# EAGLE design TTGO_shield_revF (EAGLE 9.0.1)
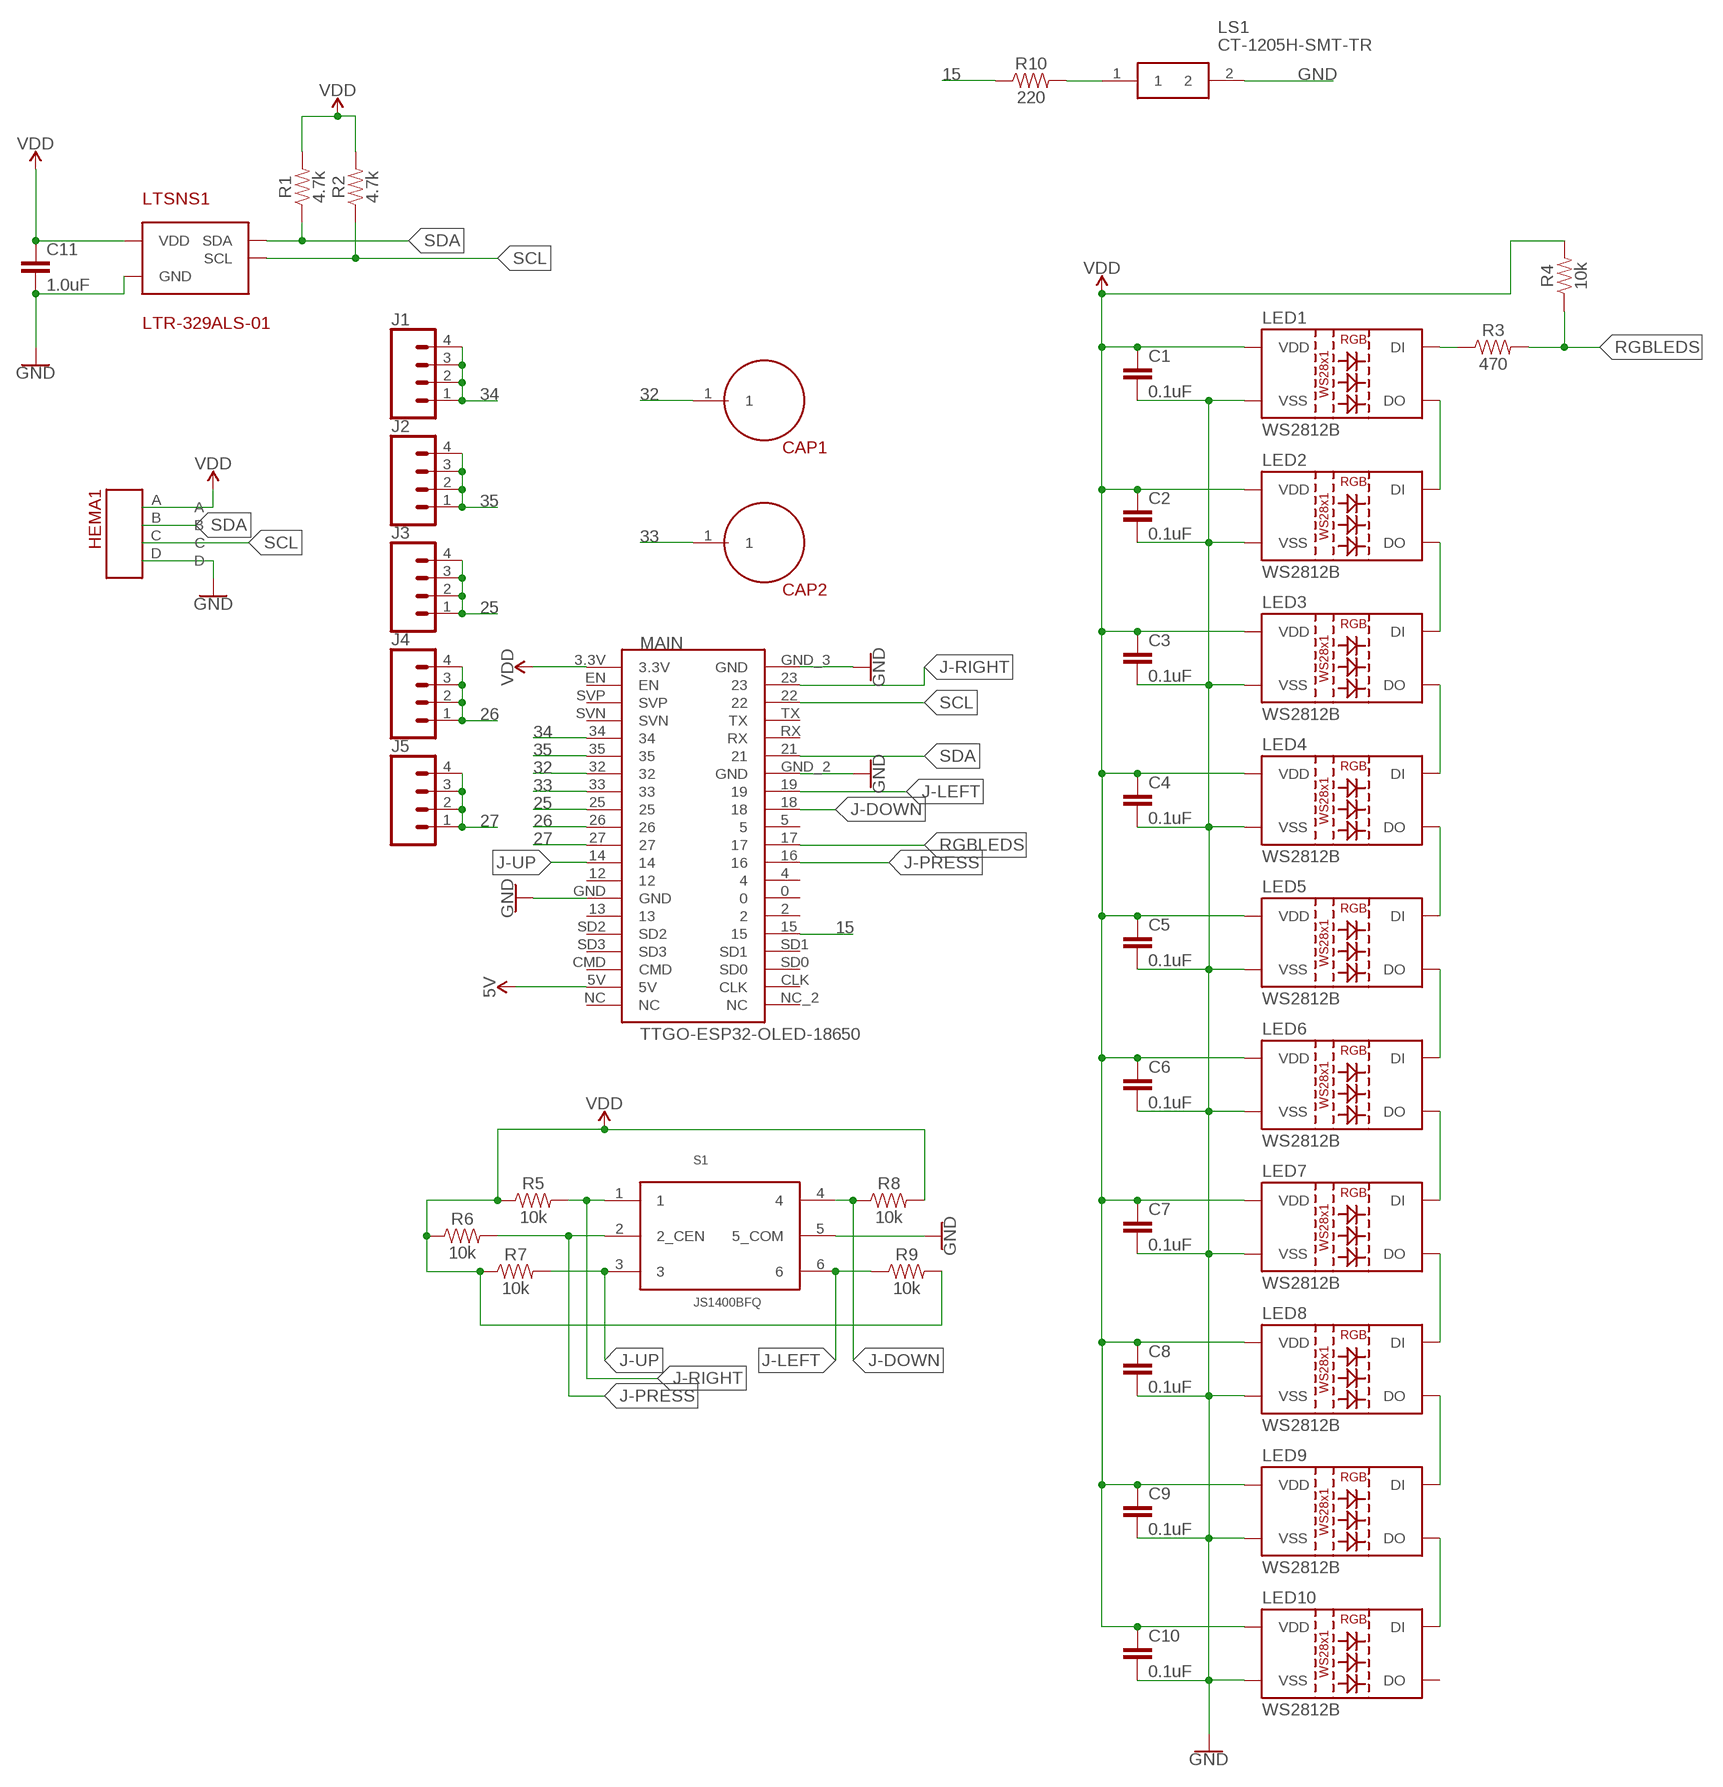
[diagram p0: schematic, sheet 1]

## Parts
C1  0.1uF  0.1UF-0603-25V-5%  [0603]
C2  0.1uF  0.1UF-0603-25V-5%  [0603]
C3  0.1uF  0.1UF-0603-25V-5%  [0603]
C4  0.1uF  0.1UF-0603-25V-5%  [0603]
C5  0.1uF  0.1UF-0603-25V-5%  [0603]
C6  0.1uF  0.1UF-0603-25V-5%  [0603]
C7  0.1uF  0.1UF-0603-25V-5%  [0603]
C8  0.1uF  0.1UF-0603-25V-5%  [0603]
C9  0.1uF  0.1UF-0603-25V-5%  [0603]
C10  0.1uF  0.1UF-0603-25V-5%  [0603]
C11  1.0uF  1.0UF-0805-25V-10%  [0805]
CAP1  CAPSENSE_BUTTON  [CAPSENSE_BUTTON]
CAP2  CAPSENSE_BUTTON  [CAPSENSE_BUTTON]
HEMA1  10120045-400LF  [10120045-400LF]
J1  CONN_04LONGPADS  [1X04_LONGPADS]
J2  CONN_04LONGPADS  [1X04_LONGPADS]
J3  CONN_04LONGPADS  [1X04_LONGPADS]
J4  CONN_04LONGPADS  [1X04_LONGPADS]
J5  CONN_04LONGPADS  [1X04_LONGPADS]
LED1  WS2812B  [WS2812B]
LED2  WS2812B  [WS2812B]
LED3  WS2812B  [WS2812B]
LED4  WS2812B  [WS2812B]
LED5  WS2812B  [WS2812B]
LED6  WS2812B  [WS2812B]
LED7  WS2812B  [WS2812B]
LED8  WS2812B  [WS2812B]
LED9  WS2812B  [WS2812B]
LED10  WS2812B  [WS2812B]
LS1  CT-1205H-SMT-TR  [CT1205HSMTTR]
LTSNS1  LTR-329ALS-01  [CHIPLED-4]
MAIN  TTGO-ESP32-OLED-18650  [TTGO-ESP32-OLED-18650]
R1  4.7k  4.7KOHM-0603-1/10W-1%  [0603]
R2  4.7k  4.7KOHM-0603-1/10W-1%  [0603]
R3  470  470OHM-0603-1/10W-1%  [0603]
R4  10k  10KOHM-0603-1/10W-1%  [0603]
R5  10k  10KOHM-0603-1/10W-1%  [0603]
R6  10k  10KOHM-0603-1/10W-1%  [0603]
R7  10k  10KOHM-0603-1/10W-1%  [0603]
R8  10k  10KOHM-0603-1/10W-1%  [0603]
R9  10k  10KOHM-0603-1/10W-1%  [0603]
R10  220  470OHM-0603-1/10W-1%  [0603]
S1  JS1400BFQ  [JS1400BFQ]

## Nets
5V: MAIN.5V
15: MAIN.15 R10.1
25: J3.1 J3.2 J3.3 J3.4 MAIN.25
26: J4.1 J4.2 J4.3 J4.4 MAIN.26
27: J5.1 J5.2 J5.3 J5.4 MAIN.27
32: CAP1.1 MAIN.32
33: CAP2.1 MAIN.33
34: J1.1 J1.2 J1.3 J1.4 MAIN.34
35: J2.1 J2.2 J2.3 J2.4 MAIN.35
GND [Rail]: C1.2 C2.2 C3.2 C4.2 C5.2 C6.2 C7.2 C8.2 C9.2 C10.2 C11.2 HEMA1.D LED1.3(VSS) LED2.3(VSS) LED3.3(VSS) LED4.3(VSS) LED5.3(VSS) LED6.3(VSS) LED7.3(VSS) LED8.3(VSS) LED9.3(VSS) LED10.3(VSS) LS1.2 LTSNS1.2(GND) MAIN.GND MAIN.GND_2(GND) MAIN.GND_3(GND) S1.5(5_COM)
J-DOWN: MAIN.18 R8.1 S1.4
J-LEFT: MAIN.19 R9.1 S1.6
J-PRESS: MAIN.16 R6.2 S1.2(2_CEN)
J-RIGHT: MAIN.23 R5.2 S1.1
J-UP: MAIN.14 R7.2 S1.3
N$1: LED5.2(DO) LED6.4(DI)
N$2: LED6.2(DO) LED7.4(DI)
N$3: LED7.2(DO) LED8.4(DI)
N$4: LED8.2(DO) LED9.4(DI)
N$5: LED4.2(DO) LED5.4(DI)
N$6: LED9.2(DO) LED10.4(DI)
N$7: LS1.1 R10.2
N$9: LED1.2(DO) LED2.4(DI)
N$10: LED2.2(DO) LED3.4(DI)
N$11: LED3.2(DO) LED4.4(DI)
N$12: LED1.4(DI) R3.1
RGBLEDS: MAIN.17 R3.2 R4.1
SCL: HEMA1.C LTSNS1.4(SCL) MAIN.22 R2.1
SDA: HEMA1.B LTSNS1.3(SDA) MAIN.21 R1.1
VDD [Rail]: C1.1 C2.1 C3.1 C4.1 C5.1 C6.1 C7.1 C8.1 C9.1 C10.1 C11.1 HEMA1.A LED1.1(VDD) LED2.1(VDD) LED3.1(VDD) LED4.1(VDD) LED5.1(VDD) LED6.1(VDD) LED7.1(VDD) LED8.1(VDD) LED9.1(VDD) LED10.1(VDD) LTSNS1.1(VDD) MAIN.3.3V R1.2 R2.2 R4.2 R5.1 R6.1 R7.1 R8.2 R9.2
Unconnected: LED10.2(DO) MAIN.0 MAIN.2 MAIN.4 MAIN.5 MAIN.12 MAIN.13 MAIN.CLK MAIN.CMD MAIN.EN MAIN.NC MAIN.NC_2(NC) MAIN.RX MAIN.SD0 MAIN.SD1 MAIN.SD2 MAIN.SD3 MAIN.SVN MAIN.SVP MAIN.TX

## Library data of the parts
C1-C10 = SparkFun-Capacitors:0.1UF: 0.1µF ceramic capacitors A capacitor is a passive two-terminal electrical component used to store electrical energy temporarily in an electric field.; PROD_ID: CAP-08604
C11 = SparkFun-Capacitors:1.0UF: 1µF ceramic capacitors A capacitor is a passive two-terminal electrical component used to store electrical energy temporarily in an electric field.; PROD_ID: CAP-08064
CAP1 CAP2 = BadgeParts:CAPSENSE_BUTTON: Simple pad for capsense buttons
HEMA1 = BadgeParts:10120045-400LF: SSL Connector 4 Position Blade and Receptacle, Hermaphroditic Board to Board 0.118" (3.00mm) Solder Datasheet <https://cdn.amphenol-icc.com/media/wysiwyg/files/drawing/10120045-400lf.pdf>
J1-J5 = SparkFun-Connectors:CONN_04: Multi connection point. Often used as Generic Header-pin footprint for 0.1 inch spaced/style header connections On any of the 0.1 inch spaced packages, you can populate with these: Break Away Headers - Straight <https://www.sparkfun.com/products/116> (PRT-00116) Break Away Male Headers - Right Angle <https://www.sparkfun.com/products/553> (PRT-00553) Female Headers <https://www.sparkfun.com/products/115> (PRT-00115) Break Away Headers - Machine Pin <https://www.sparkfun.com/products/117> (PRT-00117) Break Away Female Headers - Swiss Machine Pin <https://www.sparkfun.com/products/743> (PRT-00743) For SCREWTERMINALS and SPRING TERMINALS visit here: Screw Terimnals on SparkFun.com <https://www.sparkfun.com/search/results?term=Screw+Terminals> (5mm/3.5mm/2.54mm spacing) This device is also useful as a general connection point to wire up your design to another part of your project. Our various solder wires solder well into these plated through hole pads. Hook-Up Wire - Assortment (Stranded, 22 AWG) <https://www.sparkfun.com/products/11375> (PRT-11375) Hook-Up Wire - Assortment (Solid Core, 22 AWG) <https://www.sparkfun.com/products/11367> (PRT-11367) View the entire wire category on our website here <https://www.sparkfun.com/categories/141> Special notes: Molex polarized connector foot print use with SKU : PRT-08231 with associated crimp pins and housings. 1MM SMD Version SKU: PRT-10208; PROD_ID: CONN-09696
LED1-LED10 = SparkFun-LED:WS2812B: WS2812B SMD addressable RGB LED 5x5mm SMD LED with built-in controller IC. Color: Red/Green/Blue mC Rating: RGB: 390, 660, 180 mcd Forward Voltage: RGB: 2.0, 3.0, 3.0 V Packages:WS2812B SparkFun Products: Blynk Board - ESP8266 <https://www.sparkfun.com/products/13794>; PROD_ID: DIO-12503
LS1 = BadgeParts:CT-1205H-SMT-TR: Speakers & Transducers Buzzers Source: Datasheet <http://www.cui.com/product/resource/ct-1205h-smt.pdf>; ARROW_PART_NUMBER: CT-1205H-SMT-TR; ARROW_PRICE/STOCK: https://www.arrow.com/en/products/ct-1205h-smt-tr/cui-inc; DESCRIPTION: Speakers & Transducers Buzzers; HEIGHT: 10mm; MANUFACTURER_NAME: CUI; MANUFACTURER_PART_NUMBER: CT-1205H-SMT-TR
LTSNS1 = NickParts:LTR-329ALS-01
MAIN = BadgeParts:TTGO-ESP32-OLED-18650: Input-only pins: IO34, IO35, Sensor_VP, Sensor_VN, are labeled in docs as GPI (note the lack of O), which may mean they're input-only pins. Pins 4 and 5 go to the OLED SDA/SCL IO32 IO33 are connected to the crystal. Docs say you can't use these 2x pins as GPIO unless you desolder some stuff on the module. There's 5 "strapping" pins, which effect how the ESP-32 boots depending on if they're pulled high or low. So it's possible that something you've hooked upto these pins may effect how it boots. These pins are: 0 2 5 12 15
R1 R2 = SparkFun-Resistors:4.7KOHM: 4.7kΩ resistor A resistor is a passive two-terminal electrical component that implements electrical resistance as a circuit element. Resistors act to reduce current flow, and, at the same time, act to lower voltage levels within circuits. - Wikipedia; PROD_ID: RES-07857
R3 = SparkFun-Resistors:470OHM: 470Ω resistor A resistor is a passive two-terminal electrical component that implements electrical resistance as a circuit element. Resistors act to reduce current flow, and, at the same time, act to lower voltage levels within circuits. - Wikipedia; PROD_ID: RES-07869
R4-R9 = SparkFun-Resistors:10KOHM: 10kΩ resistor A resistor is a passive two-terminal electrical component that implements electrical resistance as a circuit element. Resistors act to reduce current flow, and, at the same time, act to lower voltage levels within circuits. - Wikipedia; PROD_ID: RES-00824
R10 = SparkFun-Resistors:470OHM: 470Ω resistor A resistor is a passive two-terminal electrical component that implements electrical resistance as a circuit element. Resistors act to reduce current flow, and, at the same time, act to lower voltage levels within circuits. - Wikipedia; PROD_ID: RES-07869; VALUE: 470
S1 = BadgeParts:JS1400BFQ: 5-way SMD tactile switch

## Net classes
0 Default: width 0.381 mm, clearance 0.254 mm
1 Rail: width 0.635 mm, clearance 0.254 mm

## Board
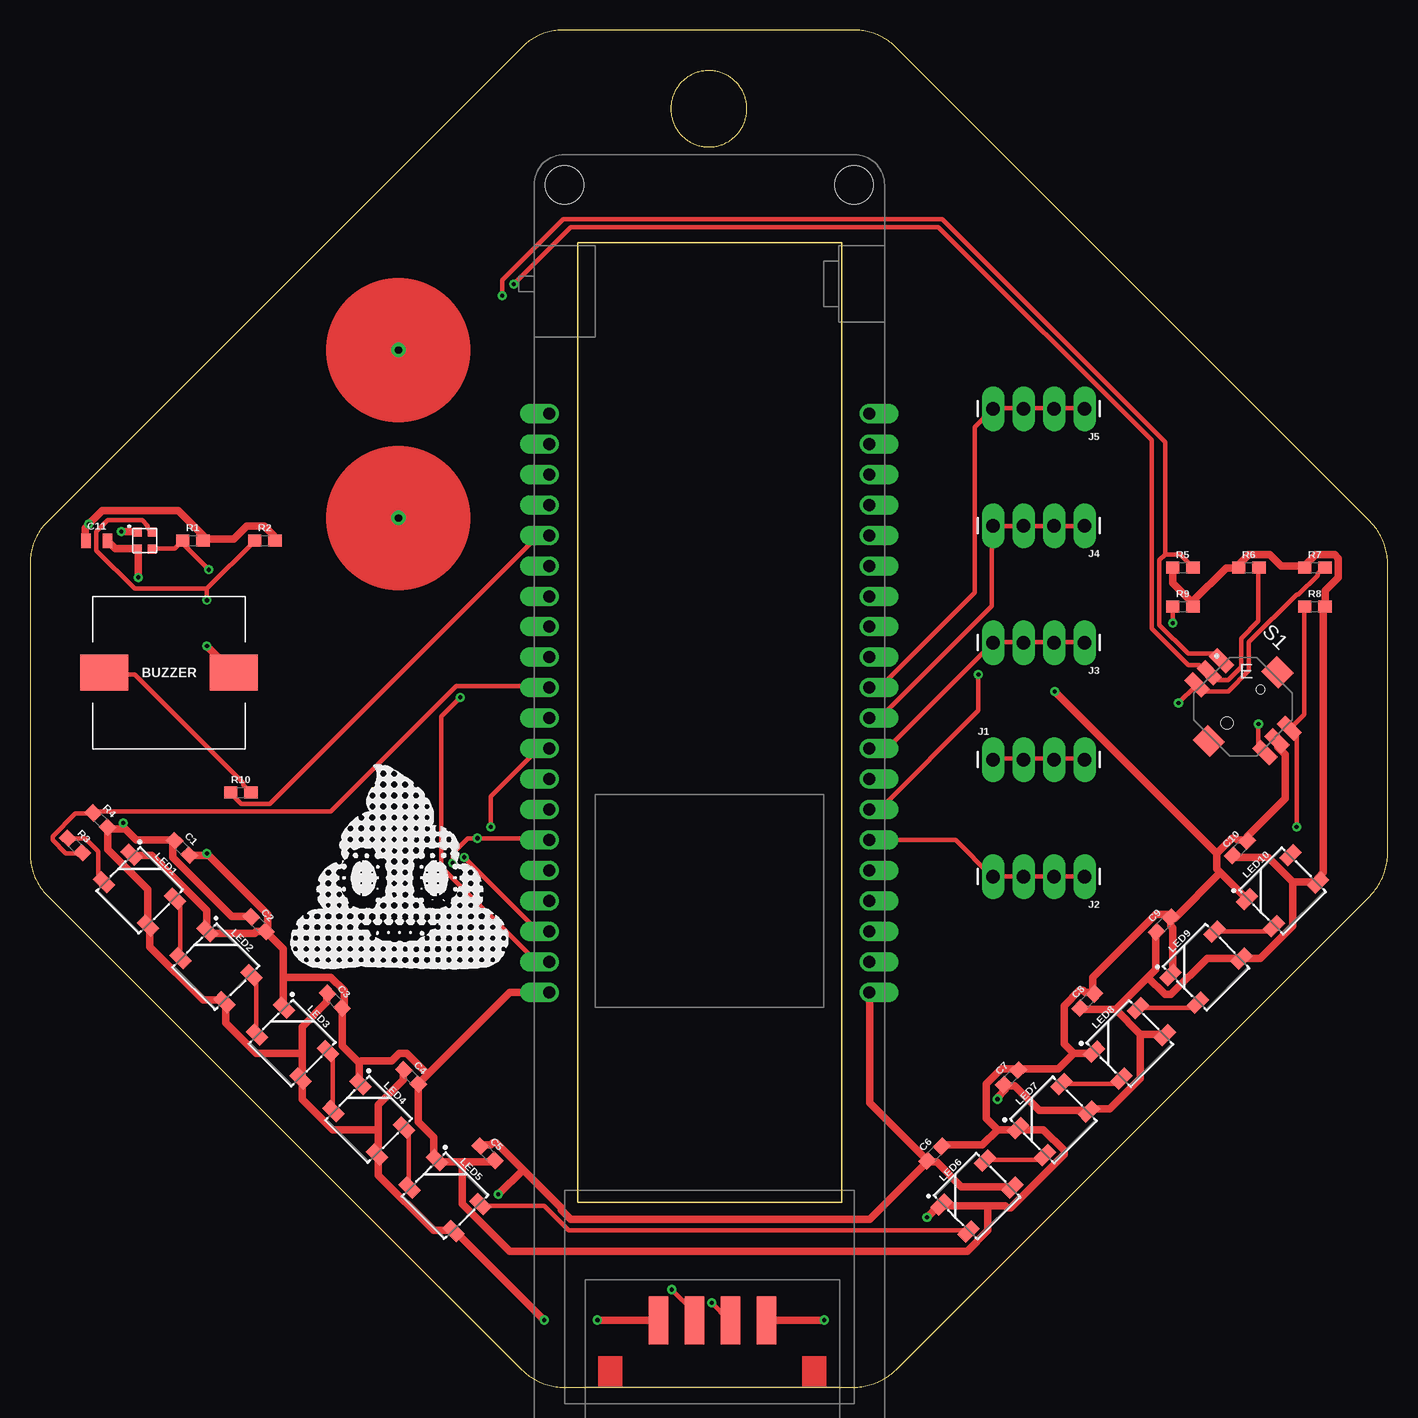
[diagram p1: board, top side]
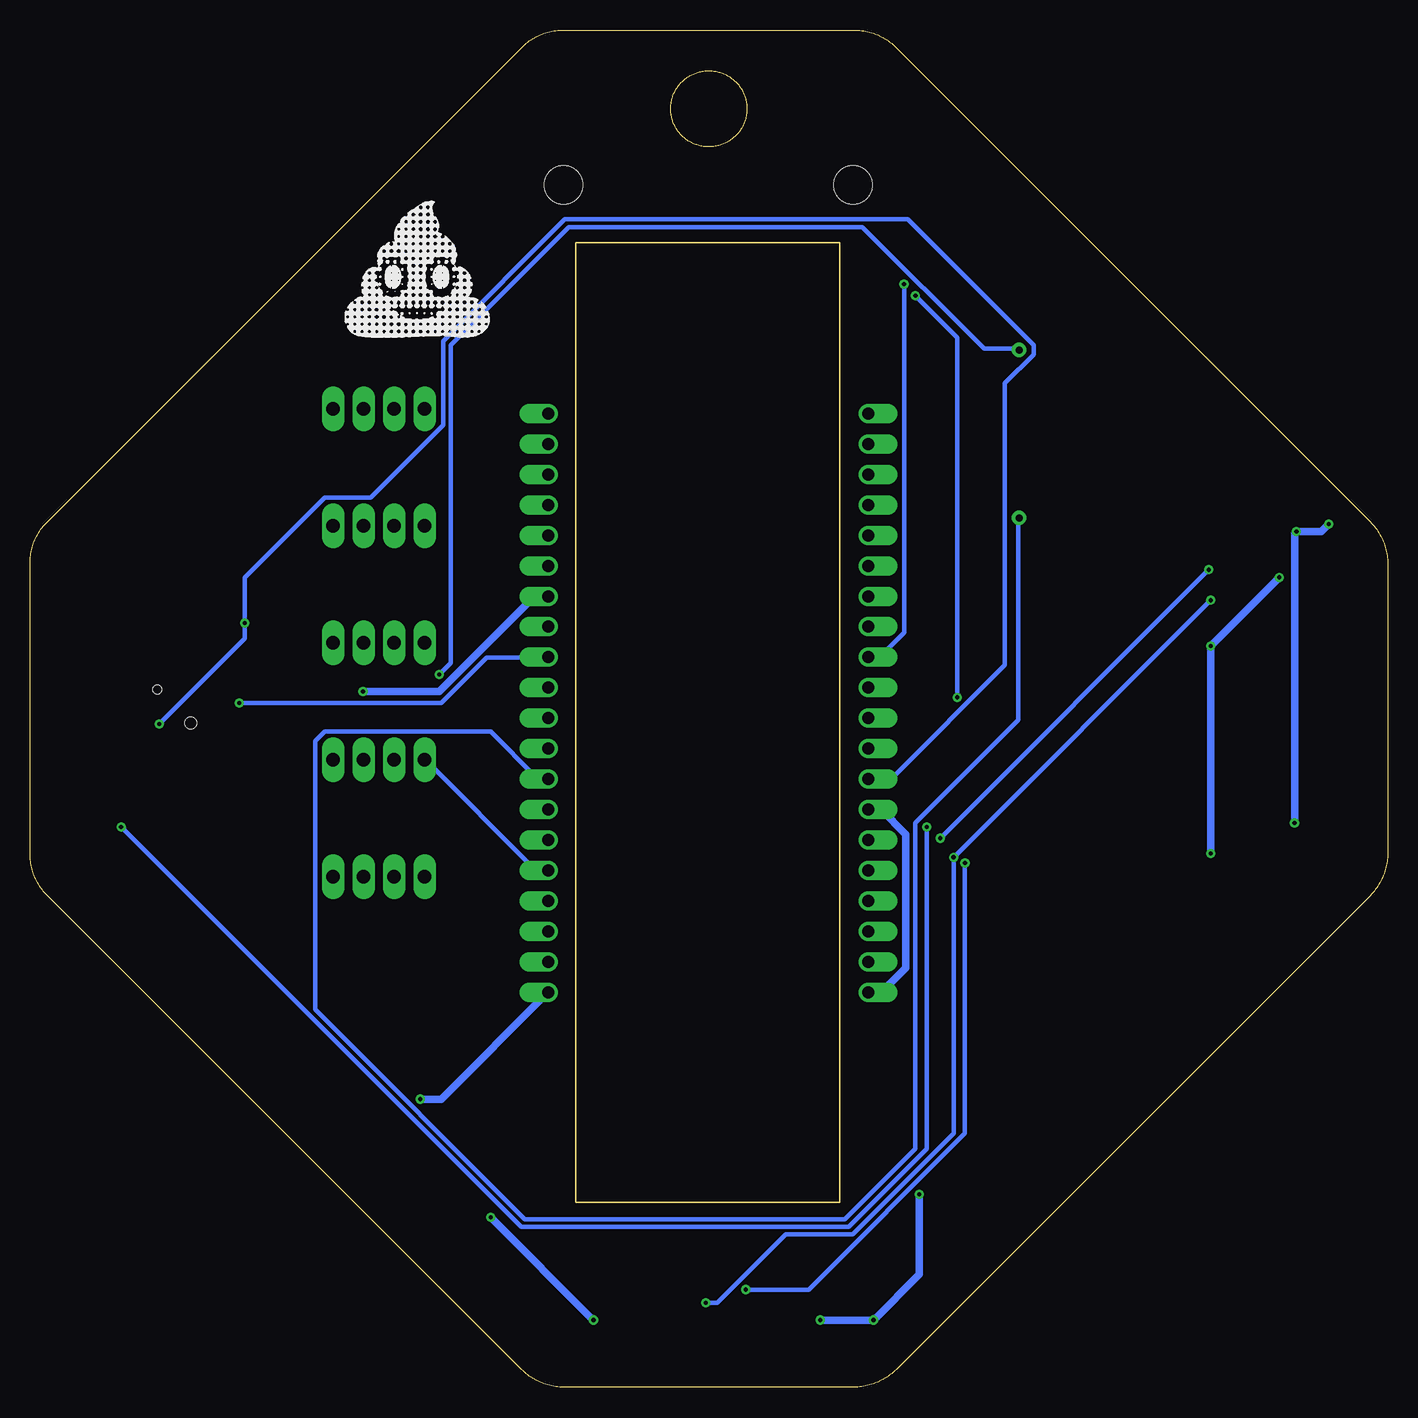
[diagram p2: board, bottom side, seen from below]

Size 113.14 x 113.14 mm. Coordinates in mm from the lower left corner, seen from the top.
Outline: 44.5,113.14 44.33,113.13 44.16,113.13 43.99,113.11 43.82,113.09 43.65,113.06 43.48,113.03 43.31,112.99 43.15,112.95 42.98,112.9 42.82,112.85 42.66,112.79 42.51,112.72 42.35,112.65 42.2,112.58 42.05,112.5 41.9,112.41 41.75,112.32 41.61,112.22 41.48,112.12 41.34,112.02 41.21,111.91 41.08,111.79 40.96,111.67 1.46,72.18 1.35,72.05 1.23,71.93 1.12,71.8 1.02,71.66 0.91,71.52 0.82,71.38 0.73,71.24 0.64,71.09 0.56,70.94 0.48,70.79 0.41,70.63 0.35,70.47 0.29,70.31 0.23,70.15 0.19,69.99 0.14,69.82 0.1,69.66 0.07,69.49 0.05,69.32 0.03,69.15 0.01,68.98 0,68.81 0,68.64 0,44.5 0,44.33 0.01,44.16 0.03,43.99 0.05,43.82 0.07,43.65 0.1,43.48 0.14,43.31 0.19,43.15 0.23,42.98 0.29,42.82 0.35,42.66 0.41,42.51 0.48,42.35 0.56,42.2 0.64,42.05 0.73,41.9 0.82,41.76 0.91,41.61 1.02,41.48 1.12,41.34 1.23,41.21 1.35,41.08 1.46,40.96 40.96,1.46 41.08,1.35 41.21,1.23 41.34,1.12 41.48,1.02 41.61,0.92 41.75,0.82 41.9,0.73 42.05,0.64 42.2,0.56 42.35,0.48 42.51,0.41 42.66,0.35 42.82,0.29 42.98,0.23 43.15,0.19 43.31,0.14 43.48,0.1 43.65,0.07 43.82,0.05 43.99,0.03 44.16,0.01 44.33,0 44.5,0 68.64,0 68.81,0 68.98,0.01 69.15,0.03 69.32,0.05 69.49,0.07 69.66,0.1 69.82,0.14 69.99,0.19 70.15,0.23 70.31,0.29 70.47,0.35 70.63,0.41 70.79,0.48 70.94,0.56 71.09,0.64 71.24,0.73 71.38,0.82 71.52,0.92 71.66,1.02 71.79,1.12 71.93,1.23 72.05,1.35 72.17,1.46 111.67,40.96 111.79,41.08 111.91,41.21 112.02,41.34 112.12,41.48 112.22,41.61 112.32,41.76 112.41,41.9 112.5,42.05 112.58,42.2 112.65,42.35 112.72,42.51 112.79,42.66 112.85,42.82 112.9,42.98 112.95,43.15 112.99,43.31 113.03,43.48 113.06,43.65 113.09,43.82 113.11,43.99 113.13,44.16 113.13,44.33 113.14,44.5 113.14,68.64 113.13,68.81 113.13,68.98 113.11,69.15 113.09,69.32 113.06,69.49 113.03,69.66 112.99,69.82 112.95,69.99 112.9,70.15 112.85,70.31 112.79,70.47 112.72,70.63 112.65,70.79 112.58,70.94 112.5,71.09 112.41,71.24 112.32,71.38 112.22,71.52 112.12,71.66 112.02,71.8 111.91,71.93 111.79,72.05 111.67,72.18 72.17,111.67 72.05,111.79 71.93,111.91 71.79,112.02 71.66,112.12 71.52,112.22 71.38,112.32 71.24,112.41 71.09,112.5 70.94,112.58 70.79,112.65 70.63,112.72 70.47,112.79 70.31,112.85 70.15,112.9 69.99,112.95 69.82,112.99 69.66,113.03 69.49,113.06 69.32,113.09 69.15,113.11 68.98,113.13 68.81,113.13 68.64,113.14 44.5,113.14
Outline: 59.74,106.57 59.74,106.68 59.74,106.79 59.73,106.9 59.71,107.01 59.7,107.12 59.67,107.23 59.65,107.33 59.62,107.44 59.59,107.54 59.55,107.65 59.51,107.75 59.47,107.85 59.43,107.95 59.38,108.05 59.32,108.15 59.27,108.24 59.21,108.34 59.14,108.43 59.08,108.51 59.01,108.6 58.94,108.68 58.86,108.76 58.78,108.84 58.7,108.92 58.62,108.99 58.54,109.06 58.45,109.13 58.36,109.19 58.27,109.25 58.17,109.31 58.08,109.36 57.98,109.41 57.88,109.46 57.78,109.5 57.67,109.54 57.57,109.58 57.47,109.61 57.36,109.64 57.25,109.67 57.14,109.69 57.03,109.71 56.93,109.72 56.82,109.73 56.71,109.74 56.6,109.74 56.49,109.74 56.38,109.74 56.27,109.73 56.16,109.72 56.05,109.7 55.94,109.68 55.83,109.66 55.72,109.63 55.62,109.6 55.51,109.56 55.41,109.53 55.31,109.48 55.21,109.44 55.11,109.39 55.01,109.34 54.92,109.28 54.82,109.22 54.73,109.16 54.64,109.09 54.56,109.03 54.47,108.95 54.39,108.88 54.31,108.8 54.24,108.72 54.16,108.64 54.09,108.56 54.03,108.47 53.96,108.38 53.9,108.29 53.84,108.2 53.79,108.1 53.74,108 53.69,107.9 53.64,107.8 53.6,107.7 53.56,107.6 53.53,107.49 53.5,107.39 53.47,107.28 53.45,107.17 53.43,107.06 53.42,106.95 53.41,106.84 53.4,106.73 53.39,106.62 53.39,106.51 53.4,106.4 53.41,106.29 53.42,106.18 53.43,106.07 53.45,105.97 53.47,105.86 53.5,105.75 53.53,105.65 53.56,105.54 53.6,105.44 53.64,105.33 53.69,105.23 53.74,105.13 53.79,105.04 53.84,104.94 53.9,104.85 53.96,104.76 54.03,104.67 54.09,104.58 54.16,104.5 54.24,104.41 54.31,104.33 54.39,104.26 54.47,104.18 54.56,104.11 54.64,104.04 54.73,103.98 54.82,103.92 54.92,103.86 55.01,103.8 55.11,103.75 55.21,103.7 55.31,103.65 55.41,103.61 55.51,103.57 55.62,103.54 55.72,103.51 55.83,103.48 55.94,103.46 56.05,103.44 56.16,103.42 56.27,103.41 56.38,103.4 56.49,103.39 56.6,103.39 56.71,103.4 56.82,103.4 56.93,103.41 57.03,103.43 57.14,103.45 57.25,103.47 57.36,103.49 57.47,103.52 57.57,103.56 57.67,103.59 57.78,103.63 57.88,103.68 57.98,103.72 58.08,103.77 58.17,103.83 58.27,103.89 58.36,103.95 58.45,104.01 58.54,104.08 58.62,104.15 58.7,104.22 58.78,104.29 58.86,104.37 58.94,104.45 59.01,104.54 59.08,104.62 59.14,104.71 59.21,104.8 59.27,104.89 59.32,104.99 59.38,105.09 59.43,105.18 59.47,105.28 59.51,105.39 59.55,105.49 59.59,105.59 59.62,105.7 59.65,105.8 59.67,105.91 59.7,106.02 59.71,106.13 59.73,106.24 59.74,106.35 59.74,106.46 59.74,106.57
Copper layers (1*16): Top 0.035mm / dielectric 1.5mm / Bottom 0.035mm
Design rules "default *": minimum track width 6mil, minimum drill 0.35mm, track to track 6mil, track to pad 6mil, pad to pad 6mil, via to via 6mil, smd to smd 6mil, copper to edge 40mil, drill to drill 6mil, minimum pad ring 12mil, minimum via ring 8mil, stop-mask expansion 4mil, vias tented up to drill 0mil, thermal gap 10mil

### Footprints (pad centres in the part's own frame; a part is rotated, then mirrored left to right if it is on the bottom)
0603 = smd 1.1 x 1: 1 -0.85,0; 2 0.85,0
0805 = smd 0.8 x 1.2: 1 -0.9,0; 2 0.9,0
CAPSENSE_BUTTON = drill 0.6: 1 0,0
10120045-400LF = smd 1.6 x 4: A 0.8,2; B 3.8,2; C 6.8,2; D 9.8,2
1X04_LONGPADS = drill 1.118 pad 1.88 long: 1 0,0; 2 2.54,0; 3 5.08,0; 4 7.62,0
WS2812B = smd 1.651 x 1: 1 2.577,-1.6; 2 2.577,1.6; 3 -2.577,1.6; 4 -2.577,-1.6
CT1205HSMTTR = smd 4 x 3: 1 -5.4,0; 2 5.4,0
CHIPLED-4 = smd 0.7 x 0.75: 1 -0.6,0.7; 2 -0.6,-0.7; 3 0.6,-0.7; 4 0.6,0.7
TTGO-ESP32-OLED-18650 = drill 1 offset: 0 26.67,16.51; 2 26.67,13.97; 3.3V 0,49.53; 4 26.67,19.05; 5 26.67,26.67; 5V 0,3.81; 12 0,19.05; 13 0,13.97; 14 0,21.59; 15 26.67,11.43; 16 26.67,21.59; 17 26.67,24.13; 18 26.67,29.21; 19 26.67,31.75; 21 26.67,36.83; 22 26.67,44.45; 23 26.67,46.99; 25 0,29.21; 26 0,26.67; 27 0,24.13; 32 0,34.29; 33 0,31.75; 34 0,39.37; 35 0,36.83; CLK 26.67,3.81; CMD 0,6.35; EN 0,46.99; GND 0,16.51; GND_2 26.67,34.29; GND_3 26.67,49.53; NC 0,1.27; NC_2 26.67,1.27; RX 26.67,39.37; SD0 26.67,6.35; SD1 26.67,8.89; SD2 0,11.43; SD3 0,8.89; SVN 0,41.91; SVP 0,44.45; TX 26.67,41.91 | hole 3.175: 1.27,-17.78; 25.4,-17.78
JS1400BFQ = smd 2 x 1: 1 -4,1.43; 2 -4,0; 3 -4,-1.43; 4 4,1.43; 5 4,0; 6 4,-1.43 | smd 2 x 1.8: P$1 0,4.05; P$2 0,-4.05 | hole 0.991: 0,-1.905 | hole 0.711: 0,2.032

### Placement (x,y rotation side)
C1  12.67,44.95 315 top
C2  19.03,38.59 315 top
C3  25.4,32.23 315 top
C4  31.76,25.86 315 top
C5  38.12,19.5 315 top
C6  75.38,19.46 45 top
C7  81.74,25.83 45 top
C8  88.1,32.19 45 top
C9  94.47,38.55 45 top
C10  100.83,44.92 45 top
C11  5.57,70.57 0 top
CAP1  30.71,86.46 0 top
CAP2  30.71,72.46 0 top
HEMA1  51.57,3.57 0 top
J1  80.26,52.32 0 top
J2  87.88,42.57 180 top
J3  87.88,62.07 180 top
J4  87.88,71.82 180 top
J5  87.88,81.57 180 top
LED1  9.13,41.42 315 top
LED2  15.5,35.05 315 top
LED3  21.86,28.69 315 top
LED4  28.23,22.33 315 top
LED5  34.59,15.96 315 top
LED6  78.91,15.93 45 top
LED7  85.28,22.29 45 top
LED8  91.64,28.65 45 top
LED9  98,35.02 45 top
LED10  104.37,41.38 45 top
LS1  11.57,59.57 0 top
LTSNS1  9.57,70.57 0 top
MAIN  69.94,82.44 180 top
R1  13.57,70.57 0 top
R2  19.57,70.57 0 top
R3  3.74,45.15 315 top
R4  5.86,47.28 315 top
R5  96.07,68.32 0 top
R6  101.57,68.32 0 top
R7  107.07,68.32 0 top
R8  107.07,65.07 0 top
R9  96.07,65.07 0 top
R10  17.57,49.57 0 top
S1  101.1,56.73 315 top

### Tracks (layer width: path | path; a pad name or v marks a point on that pad's centre or on a via)
15
  Top 0.381: R10.1 16.81,49.41 17.6,48.62 19.98,48.62 42.37,71 43.16,71 MAIN.15
25
  Top 0.381: J3.1 87.77,62.11 85.39,62.11 J3.2 85.23,62.11 82.85,62.11 J3.3 82.69,62.11 80.31,62.11 J3.4 80.15,61.95 71.58,53.38 69.99,53.38 MAIN.25
26
  Top 0.381: J4.1 87.77,71.79 85.39,71.79 J4.2 85.23,71.79 82.85,71.79 J4.3 82.69,71.79 80.31,71.79 J4.4 80.15,71.79 80.15,65.13 70.94,55.92 69.99,55.92 MAIN.26
27
  Top 0.381: J5.1 87.77,81.64 85.39,81.64 J5.2 85.23,81.64 82.85,81.64 J5.3 82.69,81.64 80.31,81.64 J5.4 80.15,81.48 78.72,80.05 78.72,66.24 70.94,58.46 69.99,58.46 MAIN.27
32  (via drill 0.35)
  Top 0.381: v79.04,59.41 79.04,56.4 70.94,48.3 69.99,48.3 MAIN.32
  Bottom 0.381: v79.04,59.41 78.08,60.36 78.08,86.88 68.24,96.72 43.79,96.72 33.64,86.56 30.78,86.56 CAP1.1
33
  Bottom 0.381: CAP2.1 30.78,72.43 30.78,55.6 39.35,47.03 39.35,19.88 45.22,14.01 71.89,14.01 89.36,31.47 89.36,53.86 88.56,54.65 74.75,54.65 70.94,50.84 69.99,50.84 MAIN.33
34
  Top 0.381: J1.4 87.77,52.43 85.39,52.43 J1.3 85.23,52.43 82.85,52.43 J1.2 82.69,52.43 80.31,52.43 J1.1
  Bottom 0.381: MAIN.34 69.99,43.22 71.1,43.22 80.15,52.27 J1.1
35
  Top 0.381: J2.1 87.77,42.58 85.39,42.58 J2.2 85.23,42.58 82.85,42.58 J2.3 82.69,42.58 80.31,42.58 J2.4 80.15,42.58 77.13,45.6 69.99,45.6 MAIN.35
GND  (via drill 0.35)
  Top 0.635: 27.44,27.03 26.02,28.46 26.02,31.47 C3.2 26.17,31.79 26.17,33.06 25.06,34.17 21.09,34.17 | 27.44,27.03 27.44,25.28 LED4.3 | 36.02,18.77 33.95,18.77 LED5.3 33.64,19.09 33.64,20.84 32.37,22.11 32.37,25.12 C4.2 32.52,25.44 33.16,26.07 | 36.02,18.77 38.71,18.77 C5.2 | 33.16,26.07 39.98,32.9 43.16,32.9 MAIN.GND_3 | 33.16,26.07 31.41,27.82 30.78,27.82 30.14,27.19 27.6,27.19 27.44,27.03 | C11.2 6.49,70.52 7.12,69.89 8.87,69.89 LTSNS1.2 9.03,69.57 v9.03,67.51 | v14.74,61.79 LS1.2 | C2.2 19.51,37.98 18.87,37.98 18.71,37.82 15.06,37.82 14.9,37.98 LED2.3 14.74,38.3 14.74,39.73 10.14,44.33 8.55,44.33 LED1.3 | 14.74,44.33 14.9,44.33 19.82,39.41 19.82,38.14 C2.2 | 14.74,44.33 13.32,44.33 C1.2 | 21.09,34.17 21.09,36.55 19.82,37.82 C2.2 | 21.09,34.17 21.09,31.79 LED3.3 | v14.74,44.49 14.74,44.33 | 86.97,27.82 85.71,26.55 82.37,26.55 C7.2 82.05,26.55 80.94,26.55 79.67,25.28 79.67,22.42 80.62,21.47 | 86.97,27.82 88.56,27.82 LED8.3 | 86.97,27.82 86.18,28.61 86.18,31.79 87.45,33.06 87.77,33.06 87.93,32.9 88.56,32.9 C8.2 88.56,33.22 88.56,34.17 93.8,39.41 94.91,39.41 C9.2 | 80.62,21.47 79.36,20.2 76.02,20.2 C6.2 | 80.62,21.47 82.21,21.47 LED7.3 82.53,21.47 84.43,21.47 86.18,19.72 86.18,19.41 81.74,14.96 81.42,14.96 81.26,15.12 79.83,15.12 | 79.83,15.12 76.02,15.12 LED6.3 75.7,15.12 v74.75,14.17 | v66.18,5.6 61.42,5.6 HEMA1.D | C9.2 95.07,39.09 95.07,38.46 95.23,38.3 95.23,34.49 95.07,34.33 LED9.3 | 98.88,44.49 100.15,45.76 100.47,45.76 100.63,45.6 101.42,45.6 C10.2 101.42,45.92 104.6,49.09 104.6,52.74 103.96,53.38 103.96,53.86 S1.5 | 98.88,44.49 98.88,43.22 99.2,42.9
  Top 0.635: 99.2,42.9 101.26,40.84 LED10.3 | 99.2,42.9 95.39,39.09 C9.2 | 98.88,44.49 v85.39,57.98 | 36.02,18.77 36.02,15.28 39.98,11.31 78.08,11.31 79.83,13.06 79.83,15.12
  Bottom 0.635: MAIN.GND_2 43.16,48.14 42.21,48.14 40.14,46.08 40.14,34.96 42.05,33.06 43.16,33.06 MAIN.GND_3 | v9.03,67.51 v14.74,61.79 v14.74,44.49 | v74.75,14.17 v66.18,5.6 | v85.39,57.98 79.04,57.98 71.1,65.92 69.99,65.92 MAIN.GND
J-DOWN  (via drill 0.35)
  Top 0.381: R8.1 106.18,64.97 106.18,56.08 105.07,54.97 S1.4 105.07,54.81 105.55,54.33 v105.55,46.71 | v38.4,46.71 38.4,49.25 42.37,53.22 43.16,53.22 MAIN.18
  Bottom 0.381: v38.4,46.71 38.4,19.88 44.91,13.37 72.21,13.37 v105.55,46.71
J-LEFT  (via drill 0.35)
  Top 0.381: v95.23,63.7 95.23,64.97 R9.1 | v102.37,55.28 102.37,53.38 102.85,52.9 S1.6
  Bottom 0.381: v102.37,55.28 95.23,62.43 v95.23,63.7 95.23,67.51 88.56,74.18 84.75,74.18 78.72,80.21 78.72,87.19 68.56,97.35 39.98,97.35 29.51,86.88 29.51,86.08 31.89,83.7 31.89,60.21 41.25,50.84 43.16,50.84 MAIN.19
J-PRESS  (via drill 0.35)
  Top 0.381: R6.2 102.37,68.3 102.37,63.86 100.94,62.43 100.94,60.05 99.83,58.94 98.88,58.94 98.4,59.41 S1.2 98.09,59.57 97.45,60.21 96.5,60.21 93.48,63.22 93.48,78.94 75.7,96.72 45.06,96.72 v40.3,91.96
  Bottom 0.381: v40.3,91.96 40.3,62.9 42.21,61 43.16,61 MAIN.16
J-RIGHT  (via drill 0.35)
  Top 0.381: 94.6,69.41 95.86,69.41 96.82,68.46 R5.2 | 94.6,69.41 94.12,68.94 94.12,63.54 96.5,61.16 98.72,61.16 99.2,60.68 S1.1 | v35.86,57.51 34.27,55.92 34.27,43.38 42.05,35.6 43.16,35.6 MAIN.23 | v39.35,91 39.35,92.27 44.43,97.35 76.02,97.35 94.6,78.78 94.6,69.41
  Bottom 0.381: v35.86,57.51 35.86,87.51 v39.35,91
J-UP  (via drill 0.35)
  Top 0.381: R7.2 107.77,68.3 107.3,67.83 107.3,67.67 105.71,66.08 105.55,66.08 101.58,62.11 101.58,59.73 99.83,57.98 97.77,57.98 97.29,58.46 S1.3 97.14,58.46 v95.71,57.03
  Bottom 0.381: v95.71,57.03 78.88,57.03 75.07,60.84 69.99,60.84 MAIN.14
N$1
  Top 0.381: LED5.2 37.6,15.12 42.84,15.12 44.91,13.06 78.08,13.06 LED6.4
N$2
  Top 0.381: LED6.2 79.67,18.93 84.12,18.93 84.43,19.25 LED7.4
N$3
  Top 0.381: LED7.2 86.02,25.28 90.63,25.28 90.94,25.6 LED8.4
N$4
  Top 0.381: LED8.2 92.37,31.63 96.98,31.63 97.29,31.95 LED9.4
N$5
  Top 0.381: LED5.4 31.57,16.71 31.57,21.31 31.25,21.63 LED4.2
N$6
  Top 0.381: LED9.2 98.72,37.98 103.33,37.98 103.64,38.3 LED10.4
N$7
  Top 0.381: R10.2 18.4,49.57 17.76,50.2 17.76,50.36 8.71,59.41 6.17,59.41 LS1.1
N$9
  Top 0.381: LED2.4 12.52,35.76 12.52,40.36 12.2,40.68 LED1.2
N$10
  Top 0.381: LED3.4 18.87,29.41 18.87,34.01 18.55,34.33 LED2.2
N$11
  Top 0.381: LED4.4 25.22,23.06 25.22,27.66 24.9,27.98 LED3.2
N$12
  Top 0.381: R3.1 3.15,45.76 4.58,45.76 5.69,44.65 5.69,42.74 6.17,42.27 LED1.4
RGBLEDS
  Top 0.381: R3.2 4.27,44.49 3,44.49 1.89,45.6 1.89,45.92 3.79,47.82 5.22,47.82 R4.1 5.38,47.98 25.06,47.98 35.54,58.46 43.16,58.46 MAIN.17
SCL  (via drill 0.35)
  Top 0.381: 14.74,66.56 8.71,66.56 5.54,69.73 5.54,71.32 6.49,72.27 9.35,72.27 9.82,71.79 9.82,71.64 10.14,71.32 LTSNS1.4 | 14.74,66.56 18.71,70.52 R2.1 | v36.18,44.17 42.21,38.14 43.16,38.14 MAIN.22 | 14.74,66.56 v14.74,65.6 | v56.81,7.02 58.24,5.6 HEMA1.C
  Bottom 0.381: v14.74,65.6 v36.18,44.17 36.18,21.15 44.59,12.74 50.15,12.74 55.86,7.02 v56.81,7.02
SDA  (via drill 0.35)
  Top 0.381: LTSNS1.3 10.3,69.89 12.04,69.89 12.68,70.52 R1.1 12.68,70.37 v14.9,68.14 | MAIN.21 43.16,45.76 v37.29,45.76 36.49,45.76 35.22,44.49 v35.22,43.7 | v53.48,8.14 55.23,6.39 55.23,5.6 HEMA1.B
  Bottom 0.381: v37.29,45.76 v14.9,68.14 | v53.48,8.14 48.24,8.14 35.22,21.15 v35.22,43.7
VDD  (via drill 0.35)
  Top 0.635: 96.82,65.44 95.23,67.03 95.23,68.3 R5.1 | 96.82,65.44 96.82,65.13 R9.2 | 96.82,65.44 99.68,68.3 100.63,68.3 R6.1 100.79,68.62 101.58,69.41 103.33,69.41 104.28,68.46 106.18,68.46 R7.1 106.34,68.62 107.14,69.41 108.72,69.41 109.04,69.1 109.04,67.51 107.93,66.4 107.93,65.13 R8.2 107.77,64.81 107.77,42.9 107.3,42.43 LED10.1 107.3,42.11 105.23,42.11 | 105.23,42.11 103.17,44.17 100.31,44.17 C10.1 | 105.23,42.11 105.23,38.46 102.53,35.76 101.1,35.76 LED9.1 100.63,35.76 98.09,35.76 95.07,32.74 94.6,32.74 93.17,34.17 | 90.47,31.47 87.61,31.47 C8.1 | 92.53,29.41 90.47,31.47 | 92.53,29.41 94.44,29.41 LED8.1 | 90.47,31.47 93.17,34.17 | 93.17,34.17 93.8,34.81 93.8,37.82 C9.1 | 92.53,29.41 92.53,25.76 89.99,23.22 88.4,23.22 LED7.1 88.09,23.06 84.12,23.06 82.05,25.12 81.26,25.12 C7.1 81.26,24.8 80.62,24.17 v80.62,24.01 | C6.1 74.91,18.77 75.54,18.77 77.61,16.71 81.74,16.71 LED6.1 | 41.1,18.14 44.27,14.96 44.27,14.8 45.06,14.01 69.99,14.01 74.59,18.61 C6.1 | 41.1,18.14 38.87,20.36 38.56,20.36 38.4,20.2 37.6,20.2 C5.1 | MAIN.3.3V 69.99,32.9 69.99,23.69 74.59,19.09 C6.1 | v7.6,71.32 8.87,71.32 LTSNS1.1 | C11.1 4.58,70.68 4.58,71.64 v4.9,71.95 6.01,73.06 12.36,73.06 14.43,71 R1.2 14.43,70.68 16.97,70.68 18.08,71.79 19.51,71.79 20.3,71 20.3,70.68 R2.2 | 7.92,46.55 8.87,45.6 12.04,45.6 C1.1 11.89,45.28 11.89,44.17 16.81,39.25 18.4,39.25 C2.1 | 7.92,46.55 6.49,46.55 R4.2 6.49,46.24 6.49,44.81 9.82,41.47 9.82,38.62 LED1.1 9.98,38.3 9.98,36.71 14.43,32.27 16.01,32.27 LED2.1 16.33,31.95 16.33,30.36 18.87,27.82 22.68,27.82 | v7.76,47.03 7.76,46.71 7.92,46.55
  Top 0.635: 22.68,27.82 22.68,25.76 LED3.1 22.68,25.44 22.68,24.01 25.22,21.47 29.03,21.47 | 22.68,27.82 22.68,30.04 24.75,32.11 24.75,32.74 C3.1 | 29.03,21.47 29.03,19.41 LED4.1 29.03,19.09 29.03,17.66 33.64,13.06 35.22,13.06 LED5.1 35.54,12.9 v42.84,5.6 | 29.03,21.47 29.03,23.53 31.09,25.6 31.09,26.39 C4.1 | v47.29,5.6 52.37,5.6 HEMA1.A | v39.03,16.07 41.1,18.14
  Bottom 0.635: v4.9,71.95 5.54,71.32 v7.6,71.32 7.76,71.16 v7.76,47.03 | v47.29,5.6 v42.84,5.6 39.03,9.41 v39.03,16.07 | v80.62,24.01 78.88,24.01 69.99,32.9 MAIN.3.3V

### Text on the board
bPlace: /Users/taylor/Documents/Github/CAAint/Media/Poop_Emoji_7b204f05-eec6-4496-91b1-351acc03d2c7_large.bmp